# EAGLE design power supply (EAGLE 9.6.2)
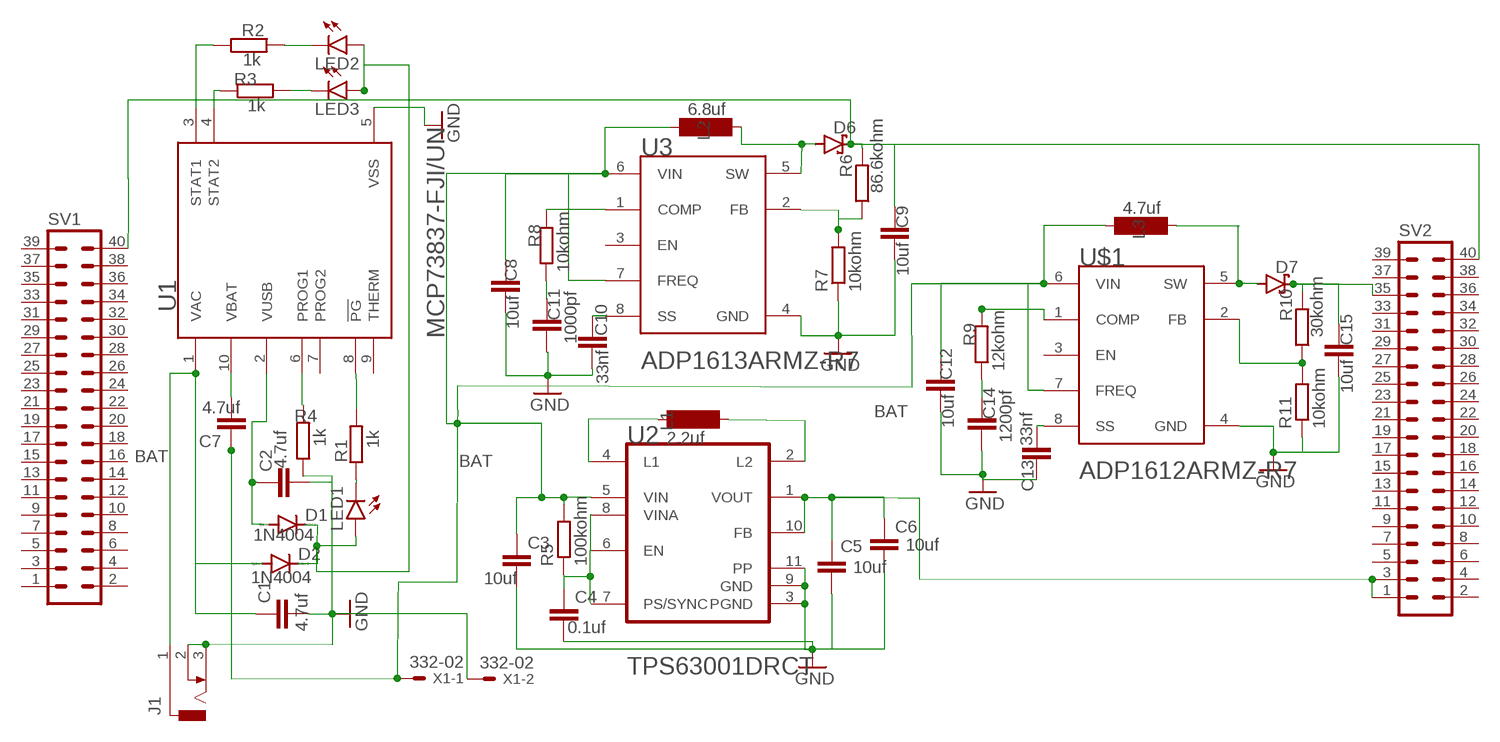
[diagram p0: schematic, sheet 1]

## Parts
C1  4.7uf  C-EU025-024X044  [C025-024X044]
C2  4.7uf  C-EU025-024X044  [C025-024X044]
C3  10uf  C-EUC0201  [C0201]
C4  0.1uf  C-EUC0201  [C0201]
C5  10uf  C-EUC0201  [C0201]
C6  10uf  C-EUC0201  [C0201]
C7  4.7uf  C-EU025-024X044  [C025-024X044]
C8  10uf  C-EUC0201  [C0201]
C9  10uf  C-EUC0201  [C0201]
C10  33nf  C-EUC0201  [C0201]
C11  1000pf  C-EUC0201  [C0201]
C12  10uf  C-EUC0201  [C0201]
C13  33nf  C-EUC0201  [C0201]
C14  1200pf  C-EUC0201  [C0201]
C15  10uf  C-EUC0201  [C0201]
D1  1N4004  [DO41-10]
D2  1N4004  [DO41-10]
D6  P4KEXX  [DO41-10]
D7  P4KEXX  [DO41-10]
J1  DCJ0303  [DCJ0303]
L1  2.2uf  SD75  [SD75]
L2  6.8uf  SD75  [SD75]
L3  4.7uf  SD75  [SD75]
LED1  LED  [SMARTLED-TTW]
LED2  LED  [SMARTLED-TTW]
LED3  LED  [SMARTLED-TTW]
R1  1k  R-EU_01005  [R01005]
R2  1k  R-EU_01005  [R01005]
R3  1k  R-EU_01005  [R01005]
R4  1k  R-EU_01005  [R01005]
R5  100kohm  R-EU_01005  [R01005]
R6  86.6kohm  R-EU_01005  [R01005]
R7  10kohm  R-EU_01005  [R01005]
R8  10kohm  R-EU_01005  [R01005]
R9  12kohm  R-EU_01005  [R01005]
R10  30kohm  R-EU_01005  [R01005]
R11  10kohm  R-EU_01005  [R01005]
SV1  40P  [40P]
SV2  40P  [40P]
U1  MICROCHIP_MCP73837-FJI-UNMICROCHIP_MCP73837-FJI-UN_0_0  [MICROCHIP_MCP73837-FJI-UN_0]
U2  TEXAS_INSTRUMENTS_TPS63001DRCTTEXAS_INSTRUMENTS_TPS63001DRCT_0_0  [TEXAS_INSTRUMENTS_TPS63001DRCT_0]
U3  ANALOG_DEVICES_INC_ADP1613ARMZ-R7ANALOG_DEVICES_INC_ADP1613ARMZ-R7_0_0  [ANALOG_DEVICES_INC_ADP1613ARMZ-R7_0]
U$1  ADP1612  [ADP1612]
X1  332-02  [332-02]

## Nets
BAT: C3.1 C7.1 C8.1 C12.1 L2.1 L3.1 R5.2 U2.5(VIN) U3.6(VIN) U3.7(FREQ) U$1.6(VIN) U$1.7(FREQ) X1.1
BATCHARGEER: D1.C D2.C LED1.A@1(A) LED2.A@1(A) LED3.A@1(A)
GND: C1.2 C2.2 C3.2 C4.2 C5.2 C6.2 C8.2 C9.2 C10.2 C11.2 C12.2 C13.1 C14.2 C15.2 J1.2 J1.3 R4.1 R7.1 R11.1 U1.5(VSS) U2.3(PGND) U2.9(GND) U2.11(PP) U3.4(GND) U$1.4(GND) X1.2
N$1: C1.1 D2.A J1.1 U1.1(VAC)
N$2: C2.1 D1.A U1.2(VUSB)
N$3: R3.1 U1.4(STAT2)
N$4: LED2.C@1(C) R2.2
N$5: R4.2 U1.6(PROG1)
N$6: R1.2 U1.8(!PG!)
N$7: LED1.C@1(C) R1.1
N$8: LED3.C@1(C) R3.2
N$10: R2.1 U1.3(STAT1)
N$11: C13.2 U$1.8(SS)
N$12: C7.2 U1.10(VBAT)
N$13: R9.2 U$1.1(COMP)
N$14: C4.1 R5.1 U2.6(EN) U2.7(PS/SYNC) U2.8(VINA)
N$17: C14.1 R9.1
N$18: L1.1 U2.4(L1)
N$20: L1.2 U2.2(L2)
N$21: C5.1 C6.1 SV2.1 SV2.3 U2.1(VOUT) U2.10(FB)
N$23: R8.2 U3.1(COMP)
N$24: C10.1 U3.8(SS)
N$25: C9.1 D6.C R6.2 SV1.40 SV2.40
N$26: R6.1 R7.2 U3.2(FB)
N$27: C11.1 R8.1
N$30: C15.1 D7.C R10.2 SV2.35
N$31: D7.A U$1.5(SW)
N$32: L3.2
N$33: R10.1 R11.2 U$1.2(FB)
N$34: D6.A L2.2 U3.5(SW)
Unconnected: SV1.1 SV1.2 SV1.3 SV1.4 SV1.5 SV1.6 SV1.7 SV1.8 SV1.9 SV1.10 SV1.11 SV1.12 SV1.13 SV1.14 SV1.15 SV1.16 SV1.17 SV1.18 SV1.19 SV1.20 SV1.21 SV1.22 SV1.23 SV1.24 SV1.25 SV1.26 SV1.27 SV1.28 SV1.29 SV1.30 SV1.31 SV1.32 SV1.33 SV1.34 SV1.35 SV1.36 SV1.37 SV1.38 SV1.39 SV2.2 SV2.4 SV2.5 SV2.6 SV2.7 SV2.8 SV2.9 SV2.10 SV2.11 SV2.12 SV2.13 SV2.14 SV2.15 SV2.16 SV2.17 SV2.18 SV2.19 SV2.20 SV2.21 SV2.22 SV2.23 SV2.24 SV2.25 SV2.26 SV2.27 SV2.28 SV2.29 SV2.30 SV2.31 SV2.32 SV2.33 SV2.34 SV2.36 SV2.37 SV2.38 SV2.39 U1.7(PROG2) U1.9(THERM) U3.3(EN) U$1.3(EN)

## Library data of the parts
C1-C15 = rcl:C-EU: CAPACITOR, European symbol; SPICEPREFIX: C
D1 D2 = diode:1N4004: DIODE general purpose rectifier, 1 A
D6 D7 = diode:P4KEXX: DIODE transient-voltage suppressor
J1 = con-jack:DCJ0303: DC POWER JACK Source: DCJ0303.pdf; OC_FARNELL: unknown; OC_NEWARK: unknown
L1-L3 = inductor-neosid:SD75: INDUCTOR nominal inductance, E12; OC_FARNELL: unknown; OC_NEWARK: unknown
LED1-LED3 = led:LED: LED OSRAM: - CHIPLED LG R971, LG N971, LY N971, LG Q971, LY Q971, LO R971, LY R971 LH N974, LH R974 LS Q976, LO Q976, LY Q976 LO Q996 - Hyper CHIPLED LW Q18S LB Q993, LB Q99A, LB R99A - SideLED LS A670, LO A670, LY A670, LG A670, LP A670 LB A673, LV A673, LT A673, LW A673 LH A674 LY A675 LS A676, LA A676, LO A676, LY A676, LW A676 LS A679, LY A679, LG A679 - Hyper Micro SIDELED® LS Y876, LA Y876, LO Y876, LY Y876 LT Y87S - SmartLED LW L88C, LW L88S LB L89C, LB L89S, LG L890 LS L89K, LO L89K, LY L89K LS L896, LA L896, LO L896, LY L896 - TOPLED LS T670, LO T670, LY T670, LG T670, LP T670 LSG T670, LSP T670, LSY T670, LOP T670, LYG T670 LG T671, LOG T671, LSG T671 LB T673, LV T673, LT T673, LW T673 LH T674 LS T676, LA T676, LO T676, LY T676, LB T676, LH T676, LSB T676, LW T676 LB T67C, LV T67C, LT T67C, LS T67K, LO T67K, LY T67K, LW E67C LS E67B, LA E67B, LO E67B, LY E67B, LB E67C, LV E67C, LT E67C LW T67C LS T679, LY T679, LG T679 LS T770, LO T770, LY T770, LG T770, LP T770 LB T773, LV T773, LT T773, LW T773 LH T774 LS E675, LA E675, LY E675, LS T675 LS T776, LA T776, LO T776, LY T776, LB T776 LHGB T686 LT T68C, LB T68C - Hyper Mini TOPLED® LB M676 - Mini TOPLED Santana® LG M470 LS M47K, LO M47K, LY M47K Source: http://www.osram.convergy.de LUXEON: - LUMILED® LXK2-PW12-R00, LXK2-PW12-S00, LXK2-PW14-U00, LXK2-PW14-V00 LXK2-PM12-R00, LXK2-PM12-S00, LXK2-PM14-U00 LXK2-PE12-Q00, LXK2-PE12-R00, LXK2-PE12-S00, LXK2-PE14-T00, LXK2-PE14-U00 LXK2-PB12-K00, LXK2-PB12-L00, LXK2-PB12-M00, LXK2-PB14-N00, LXK2-PB14-P00, LXK2-PB14-Q00 LXK2-PR12-L00, LXK2-PR12-M00, LXK2-PR14-Q00, LXK2-PR14-R00 LXK2-PD12-Q00, LXK2-PD12-R00, LXK2-PD12-S00 LXK2-PH12-R00, LXK2-PH12-S00 LXK2-PL12-P00, LXK2-PL12-Q00, LXK2-PL12-R00 Source: www.luxeon.com KINGBRIGHT: KA-3528ASYC Source: www.kingbright.com
R1-R11 = rcl:R-EU_: RESISTOR, European symbol; SPICEPREFIX: R
SV1 SV2 = con-dil:40P: DIL CABLE CONNECTOR
U1 = Microchip-MCP73837:MICROCHIP_MCP73837-FJI-UN: Advanced Stand-Alone Li-Ion / Li-Polymer Battery Charge Management Controller with Autonomous AC-Adapter or USB-Port Source Selection; CENTROID_NOT_SPECIFIED: No; DATASHEET: http://ww1.microchip.com/downloads/en/DeviceDoc/22071a.pdf; DIGIKEY_DESCRIPTION: IC LIION CHRGR USB/AC-IN 10MSOP; DIGIKEY_PART_NUMBER: MCP73837-FJI/UN-ND; LEAD_FREE: yes; MF: Microchip; MOUSER_PART_NUMBER: 579-MCP73837-FJI/UN; MPN: MCP73837-FJI/UN; PACKAGE: MSOP10; PREFIX: U; ROHS: yes; TEMPERATURE_RANGE_HIGH: +85°C; TEMPERATURE_RANGE_LOW: -40°C
U2 = Texas Instruments - TPS63001DRCT:TEXAS_INSTRUMENTS_TPS63001DRCT: TI-TPS63001DRC10-3000X1650TP; CIIVA_IDS: 1489690; COMPONENT_LINK_2_DESCRIPTION: Package Specification; COMPONENT_LINK_2_URL: http://www.ti.com/litv/pdf/mpds117k; DATASHEET: http://www.ti.com/general/docs/lit/getliterature.tsp?genericPartNumber=TPS63001&fileType=pdf; DATASHEET_VERSION: SLVS520B; DYNAMIC_VOLTAGE_SCALING: true; FOOTPRINT_VARIANT_NAME_0: Manufacturer Recommended; IMPORTED: yes; IMPORTED_FROM: vault; IMPORT_TS: 1521844474; IOUT_MAX_A: 1.2; IQ_TYPM_A: 0.03; MF: Texas Instruments; MOUNTING_TECHNOLOGY: Surface Mount; MPN: TPS63001DRCT; PACKAGE: DRC0010J; PACKAGE_DESCRIPTION: 10-Pin Plastic Small Outline No-Lead, 3 x 3 x 1 mm Body, 0.5 mm Pitch, Exposed Pad; PACKAGE_VERSION: revL, Sep-2011; PREFIX: U; PRESET_VOUTV: 3.3; REGULATED_OUTPUTS: 1; RELEASE_DATE: 1464604456; ROHS: Yes; SUB_FAMILY: Buck-Boost Regulator; SWITCHING_FREQUENCYMAXKHZ: 1500; SYNCHRONOUS_RECTIFICATION: true; TOPOLOGY: Buck-Boost; VAULT_GUID: 716ED092-ED52-49D4-9072-09F38C28E61B; VAULT_REVISION: 93282931-FE10-4779-AF11-DABD529239E2; VIN_MAX_V: 5.5; VIN_MIN_V: 1.8; VOUT_MAX_V: 3.3; VOUT_MIN_V: 3.3
U3 = Analog Devices Inc - ADP1613ARMZ-R7:ANALOG_DEVICES_INC_ADP1613ARMZ-R7: 650 kHz /1.3 MHz Step -Up PWM DC - to - DC Switching Converters; CENTROID_NOT_SPECIFIED: No; DATASHEET: http://www.analog.com/media/en/technical-documentation/data-sheets/ADP1612_1613.pdf; DIGIKEY_DESCRIPTION: IC ADP1613ARMZ-R7; DIGIKEY_PART_NUMBER: ADP1613ARMZ-R7CT-ND; IPC_LAND_PATTERN_NAME: SOP65P490X110-8; LEAD_FREE: yes; MF: Analog Devices Inc; MOUSER_PART_NUMBER: 584-ADP1613ARMZ-R7; MPN: ADP1613ARMZ-R7; PACKAGE: MSOP8; PREFIX: U; ROHS: yes; TEMPERATURE_RANGE_HIGH: +125°C; TEMPERATURE_RANGE_LOW: -40°C
U$1 = adp1612armz:ADP1612
X1 = con-garry:332-02: 2 Pin - 2mm Dual Row Source: www.mpe-connector.de / garry_shortform_2012.pdf

## Board
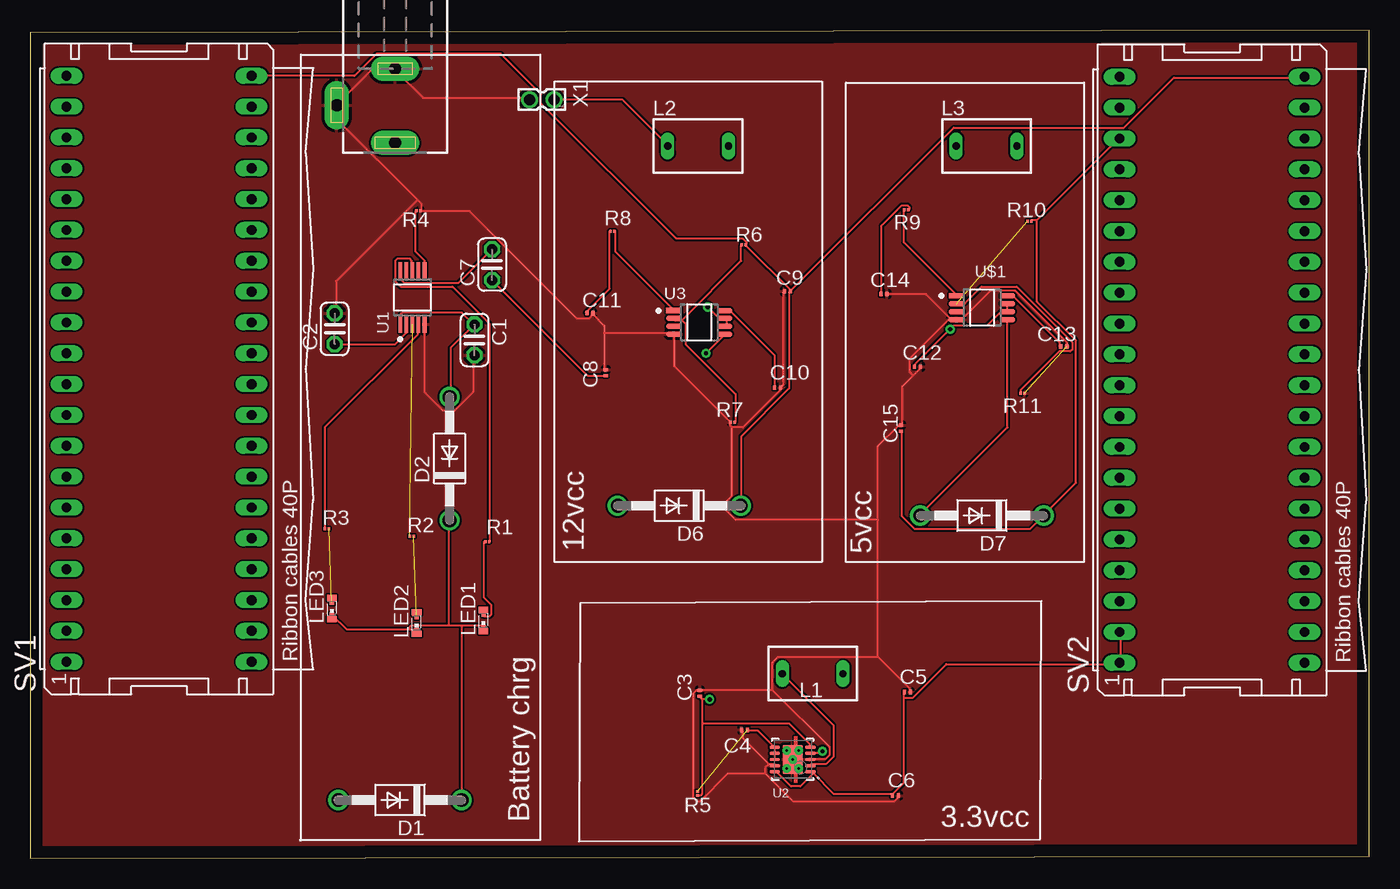
[diagram p1: board, top side]
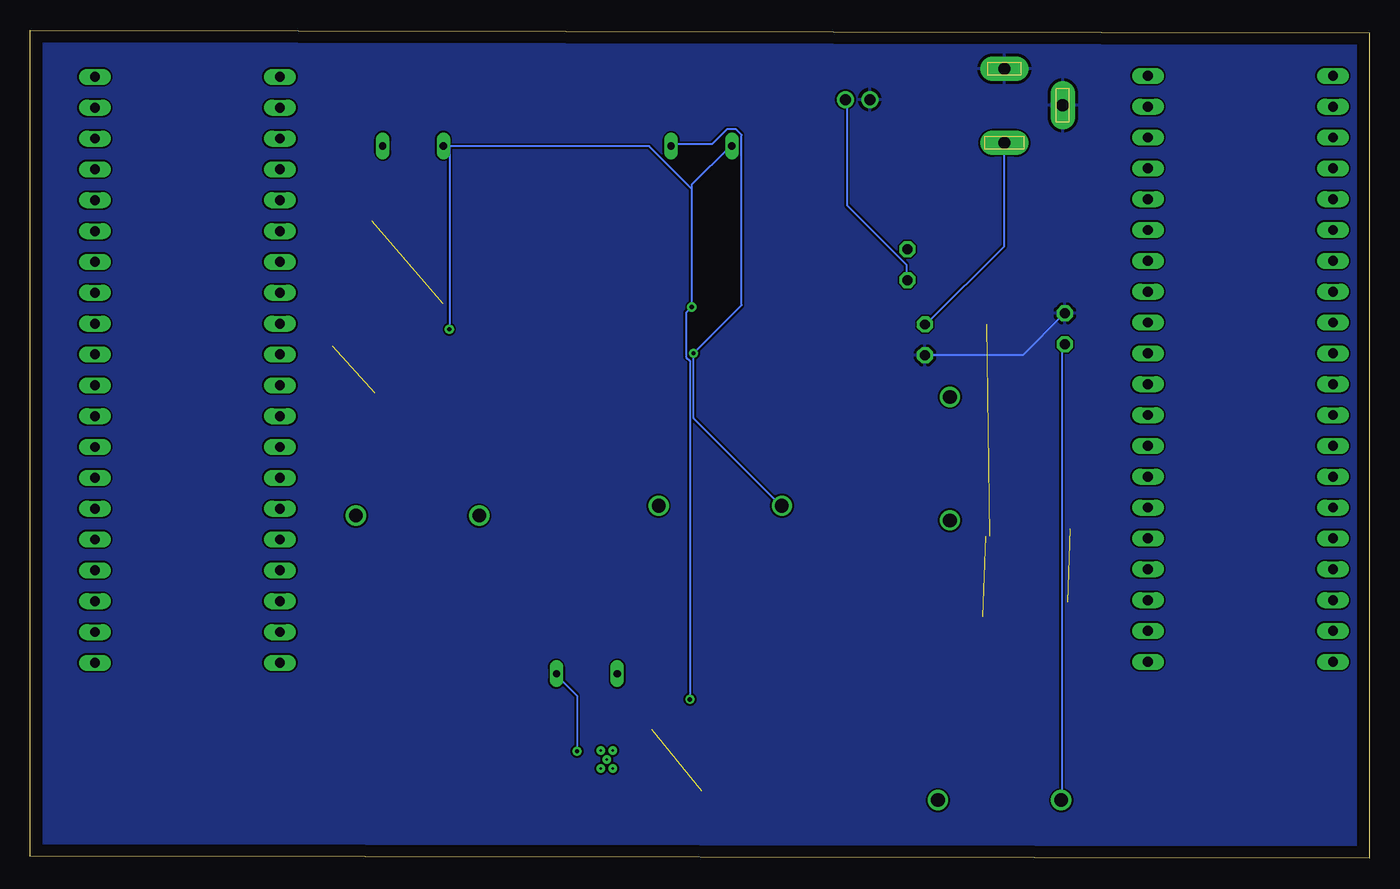
[diagram p2: board, bottom side, seen from below]

Size 110.3 x 68.2 mm. Coordinates in mm from the lower left corner, seen from the top.
Outline: 0,0 110.3,0.2 110.3,68.2 0,68 0,0
Copper layers (1*16): Top 0.035mm / dielectric 1.5mm / Bottom 0.035mm
Design rules "default": minimum track width 6mil, minimum drill 0.35mm, track to track 6mil, track to pad 6mil, pad to pad 6mil, via to via 6mil, smd to smd 6mil, copper to edge 40mil, drill to drill 6mil, minimum pad ring 10mil, minimum via ring 8mil, stop-mask expansion 4mil, vias tented up to drill 0mil, thermal gap 10mil

### Footprints (pad centres in the part's own frame; a part is rotated, then mirrored left to right if it is on the bottom)
C025-024X044 = drill 0.813 octagon: 1 -1.27,0; 2 1.27,0
C0201 = smd 0.25 x 0.35: 1 -0.25,0; 2 0.25,0
DO41-10 = drill 1.118: A 5.08,0; C -5.08,0
DCJ0303 = drill 1 pad 2 long: 1 0,3.1; 2 4.8,0; 3 0,-3
SD75 = drill 0.6 long: 1 -2.5,0; 2 2.5,0
SMARTLED-TTW = smd 0.8 x 0.5: A 0,-0.875; C 0,0.875 | smd 0.35 x 0.35: A@1 0,-0.5; C@1 0,0.5
R01005 = smd 0.2 x 0.25: 1 -0.163,0; 2 0.163,0
40P = drill 0.813 long: 1 -24.13,7.62; 2 -24.13,-7.62; 3 -21.59,7.62; 4 -21.59,-7.62; 5 -19.05,7.62; 6 -19.05,-7.62; 7 -16.51,7.62; 8 -16.51,-7.62; 9 -13.97,7.62; 10 -13.97,-7.62; 11 -11.43,7.62; 12 -11.43,-7.62; 13 -8.89,7.62; 14 -8.89,-7.62; 15 -6.35,7.62; 16 -6.35,-7.62; 17 -3.81,7.62; 18 -3.81,-7.62; 19 -1.27,7.62; 20 -1.27,-7.62; 21 1.27,7.62; 22 1.27,-7.62; 23 3.81,7.62; 24 3.81,-7.62; 25 6.35,7.62; 26 6.35,-7.62; 27 8.89,7.62; 28 8.89,-7.62; 29 11.43,7.62; 30 11.43,-7.62; 31 13.97,7.62; 32 13.97,-7.62; 33 16.51,7.62; 34 16.51,-7.62; 35 19.05,7.62; 36 19.05,-7.62; 37 21.59,7.62; 38 21.59,-7.62; 39 24.13,7.62; 40 24.13,-7.62
MICROCHIP_MCP73837-FJI-UN_0 = smd 0.3 x 1.4: 1 -1,-2.2; 2 -0.5,-2.2; 3 0,-2.2; 4 0.5,-2.2; 5 1,-2.2; 6 1,2.2; 7 0.5,2.2; 8 0,2.2; 9 -0.5,2.2; 10 -1,2.2
TEXAS_INSTRUMENTS_TPS63001DRCT_0 = smd 0.85 x 0.28: 1 -1.475,1; 2 -1.475,0.5; 3 -1.475,0; 4 -1.475,-0.5; 5 -1.475,-1; 6 1.475,-1; 7 1.475,-0.5; 8 1.475,0; 9 1.475,0.5; 10 1.475,1 | smd 1.65 x 2.4: 11 0,0 | drill 0.2 pad 0.5: PAD_1 0.5,-0.75; PAD_2 -0.5,-0.75; PAD_3 -0.5,0.75; PAD_4 0.5,0.75; PAD_5 0,0
ANALOG_DEVICES_INC_ADP1613ARMZ-R7_0 = smd 1.254 x 0.436: 1 -2.1,0.975; 2 -2.1,0.325; 3 -2.1,-0.325; 4 -2.1,-0.975; 5 2.1,-0.975; 6 2.1,-0.325; 7 2.1,0.325; 8 2.1,0.975
ADP1612 = smd 1.254 x 0.436: 1 -0.84,2.615; 2 -0.84,1.965; 3 -0.84,1.315; 4 -0.84,0.665; 5 3.36,0.665; 6 3.36,1.315; 7 3.36,1.965; 8 3.36,2.615
332-02 = drill 0.9 pad 1.27: 1 0,-1; 2 0,1

### Placement (x,y rotation side)
C1  36.59,42.71 270 top
C2  25.07,43.62 90 top
C3  55.16,13.61 90 top
C4  58.85,10.58 180 top
C5  72.25,13.7 0 top
C6  71.28,5.18 0 top
C7  38.04,48.9 90 top
C8  47.4,40 90 top
C9  62.36,46.71 180 top
C10  61.56,38.76 0 top
C11  46.1,44.92 0 top
C12  73.09,40.51 0 top
C13  85.13,42.17 180 top
C14  70.33,46.49 0 top
C15  71.73,35.45 90 top
D1  30.45,4.81 180 top
D2  34.54,32.93 90 top
D6  53.46,29.05 180 top
D7  78.4,28.24 180 top
J1  30.05,62.03 180 top
L1  64.45,15.22 180 top
L2  55.01,58.67 0 top
L3  78.77,58.68 0 top
LED1  37.33,19.59 0 top
LED2  31.82,19.39 0 top
LED3  24.84,20.59 0 top
R1  37.63,26.07 0 top
R2  31.42,26.54 0 top
R3  24.44,27.14 0 top
R4  31.96,53.35 180 top
R5  54.97,5.36 270 top
R6  58.77,50.56 0 top
R7  57.87,35.93 0 top
R8  47.96,51.65 0 top
R9  72.17,53.43 180 top
R10  82.31,52.48 0 top
R11  81.74,38.32 180 top
SV1  10.6,40.33 90 top
SV2  97.36,40.24 90 top
U1  31.48,46.21 0 top
U2  62.8,8.15 180 top
U3  55.11,44.15 0 top
U$1  77.15,43.72 0 top
X1  42.14,62.5 90 top

### Tracks (layer width: path | path; a pad name or v marks a point on that pad's centre or on a via)
BAT  (via drill 0.35)
  Top 0.152: C8.1 47.28,39.77 45.91,39.77 38.13,47.54 C7.1 | 55.35,13.1 55.35,11.12 | 55.35,11.12 55.35,5.33 55.2,5.18 55.05,5.18 R5.2 | 55.35,13.1 55.2,13.25 C3.1 | 55.35,11.12 62.52,11.12 64.19,9.44 64.19,9.14 U2.5 | C12.1 72.88,40.53 72.88,40.69 v75.78,43.58 76.08,43.89 78.82,43.89 79.89,44.95 80.5,44.95 U$1.6 80.5,45.1 80.5,45.56 U$1.7 | U3.6 57.34,43.89 57.34,44.34 U3.7 57.18,44.5 56.73,44.5 v55.81,45.41 | X1.1 43.16,62.48 48.8,62.48 52.46,58.82 L2.1 | v55.96,13.1 55.35,13.1
  Bottom 0.152: 55.81,55.16 55.81,55.47 52.61,58.67 L2.1 | 55.81,55.16 v55.81,45.41 56.27,44.95 56.27,41.3 55.96,40.99 v55.96,13.1 | 75.78,58.67 59.32,58.67 55.81,55.16 | 75.78,58.67 76.23,58.67 L3.1 75.78,58.67 | 75.78,58.67 v75.78,43.58 | C7.1 38.13,47.7 38.13,48.91 43.01,53.79 43.01,62.48 X1.1
BATCHARGEER
  Top 0.152: 31.12,18.89 26.04,18.89 LED3.A@1 | 31.12,18.89 LED2.A@1 | 34.48,19.2 31.43,19.2 31.12,18.89 | 34.48,19.2 35.54,19.2 | 35.54,19.2 37.22,19.2 LED1.A@1 | 34.48,19.2 34.48,27.73 D2.C | 35.54,19.2 35.54,4.87 D1.C
GND  (1 unrouted)
  Top 0.152: 47.28,43.28 47.28,43.89 46.36,44.8 | 47.28,43.28 47.28,40.23 C8.2 | 47.28,43.28 52.92,43.28 U3.4 53.07,43.12 53.07,40.53 57.64,35.96 | 57.64,35.96 57.64,35.66 57.79,35.5 | 57.79,35.5 58.71,35.5 61.91,38.7 C10.2 61.91,38.86 62.06,39.01 62.06,46.63 C9.2 | 57.64,35.96 R7.1 | X1.2 41.03,62.63 32.34,62.63 30.06,64.92 J1.3 29.9,64.92 28.07,64.92 25.33,62.17 J1.2 25.33,62.02 25.33,60.8 31.88,54.25 | U1.5 32.49,43.89 32.49,38.4 34.02,36.88 34.93,36.88 36.46,38.4 36.46,41.3 C1.2 | 32.19,53.34 32.19,53.94 31.88,54.25 | 31.88,54.25 25.18,47.54 25.18,44.95 C2.2 | 46.36,44.8 46.06,44.5 44.99,44.5 36.15,53.34 32.19,53.34 | 46.36,44.8 C11.2 | 32.19,53.34 R4.1 | 72.73,39.77 73.34,40.38 C12.2 | 72.73,39.77 71.81,38.86 71.81,35.81 C15.2 71.66,35.66 71.51,35.66 69.83,33.98 69.83,27.88 | C13.1 85.38,42.21 85.38,42.51 81.11,46.78 79.13,46.78 76.84,44.5 76.39,44.5 U$1.4 | 75.78,44.5 73.8,46.48 70.59,46.48 C14.2 | 75.78,44.5 76.23,44.5 U$1.4 | 72.73,39.77 72.42,40.08 72.42,41.14 75.78,44.5 | 75.78,44.5 U$1.4 | 60.84,7.77 58.71,9.9 58.71,10.51 C4.2 | 60.84,7.77 61.3,7.77 U2.9 | 60.54,7 62.82,4.72 71.2,4.72 71.51,5.02 71.51,5.18 C6.2 | 60.54,7 60.54,7.46 60.84,7.77 | 61.15,13.86 55.2,13.86 C3.2 55.05,13.86 54.9,13.86 54.59,13.56 54.59,5.02 54.9,4.72 55.2,4.72 57.49,7 60.54,7 | 61.15,13.86 65.87,9.14 65.87,8.53 65.57,8.22 64.35,8.22 U2.3 | 69.83,16.61 72.42,14.02 72.42,13.71 C5.2 | 69.83,16.61 61.6,16.61 61.15,16.15 61.15,13.86 | 69.83,16.61 69.83,27.88 | 57.79,35.5 57.79,29.86 57.34,29.41 57.34,28.65 58.1,27.88 69.83,27.88
  Bottom 0.152: C1.2 36.46,41.45 28.53,41.45 25.18,44.8 C2.2
  pour Top: -1.9,73.2 111.6,73.2 111.6,-0.9 -2,-0.9 -2,73.2
  pour Bottom: -3.1,74.6 112.7,74.6 112.7,-1.3 -3.1,-1.3
N$1
  Top 0.152: U1.1 30.51,44.04 30.51,44.8 30.67,44.95 35.54,44.95 36.46,44.04 C1.1 36.46,43.89 34.63,42.06 34.63,38.09 D2.A
  Bottom 0.152: J1.1 30.06,58.82 30.06,50.44 36.46,44.04 C1.1
N$2
  Top 0.152: U1.2 30.97,43.89 30.97,43.28 30.06,42.36 25.18,42.36 C2.1
  Bottom 0.152: D1.A 25.33,4.87 25.33,42.06 25.18,42.21 C2.1
N$3
  Top 0.152: R3.1 24.26,27.12 24.26,35.5 31.88,43.12 31.88,43.89 U1.4
N$4  (1 unrouted)
N$5
  Top 0.152: R4.2 31.73,53.34 31.73,49.98 32.49,49.22 32.49,48.46 U1.6
N$6
  Top 0.152: R1.2 37.83,26.05 37.83,44.04 34.78,47.09 30.51,47.09 30.06,47.54 30.06,49.22 30.21,49.37 31.28,49.37 31.43,49.22 31.43,48.46 U1.8
N$7
  Top 0.152: R1.1 37.37,26.05 37.37,21.48 37.98,20.87 37.98,20.11 37.83,19.96 37.37,19.96 LED1.C@1
N$8  (1 unrouted)
N$10  (1 unrouted)
N$11
  Top 0.152: C13.2 84.77,42.21 84.77,42.51 80.96,46.32 80.65,46.32 U$1.8
N$12
  Top 0.152: U1.10 30.51,48.31 30.51,47.7 30.82,47.39 35.24,47.39 37.98,50.13 C7.2
N$13
  Top 0.152: R9.2 71.97,53.34 71.97,50.74 76.23,46.48 U$1.1
N$14  (1 unrouted)
  Top 0.152: U2.8 61.3,8.22 61.3,8.53 U2.7 61.3,8.68 61.3,9.14 | 61.3,9.14 59.93,10.51 59.16,10.51 C4.1 | 61.3,9.14 U2.6
N$17
  Top 0.152: R9.1 72.42,53.49 72.42,53.64 72.27,53.79 71.81,53.79 70.14,52.12 70.14,46.63 C14.1
N$18  (via drill 0.35)
  Top 0.152: v65.26,8.83 65.11,8.68 64.35,8.68 U2.4
  Bottom 0.152: v65.26,8.83 65.26,13.41 66.94,15.08 L1.1
N$20
  Top 0.152: U2.2 64.35,7.77 65.57,7.77 66.18,8.38 66.18,10.97 62.06,15.08 L1.2
N$21
  Top 0.152: SV2.3 89.8,18.59 89.8,16.15 SV2.1 89.65,16 75.47,16 72.73,13.25 71.97,13.25 | 71.05,5.33 66.18,5.33 64.5,7 | 64.5,7 64.35,7.16 U2.1 | 71.97,13.25 71.97,6.24 71.05,5.33 | 71.97,13.25 71.97,13.56 C5.1 | 71.05,5.33 C6.1 | 64.5,7 63.43,5.94 62.67,5.94 61.45,7.16 U2.10
N$23
  Top 0.152: R8.2 48.19,51.66 48.19,49.98 52.92,45.26 U3.1
N$24
  Top 0.152: C10.1 61.3,38.86 61.3,41.45 57.64,45.1 57.34,45.1 U3.8
N$25
  Top 0.152: 62.67,46.78 59.01,50.44 R6.2 59.01,50.59 59.01,50.74 58.71,51.05 53.22,51.05 42.1,62.17 42.1,62.94 38.74,66.29 28.53,66.29 26.7,64.46 SV1.40 | 62.67,46.78 76.08,60.19 90.1,60.19 94.22,64.31 104.89,64.31 SV2.40 | 62.67,46.78 C9.1 62.52,46.63 62.52,38.7 58.55,34.74 58.55,29.1 D6.C
N$26
  Top 0.152: 53.68,44.34 53.98,44.04 53.98,42.36 58.1,38.25 58.1,35.96 R7.2 | 53.68,44.34 53.07,44.34 U3.2 | 53.68,44.34 58.55,49.22 58.55,50.44 R6.1
N$27
  Top 0.152: R8.1 47.73,51.66 47.73,46.93 45.75,44.95 C11.1
N$30
  Top 0.152: 82.94,52.57 82.48,52.57 R10.2 | 82.94,52.57 89.65,59.28 SV2.35 | C15.1 71.81,35.2 71.81,28.19 72.88,27.12 82.33,27.12 83.4,28.19 D7.C 83.55,28.34 86.14,30.93 86.14,42.67 82.94,45.87 82.94,52.57
N$31
  Top 0.152: U$1.5 80.5,44.34 80.5,35.5 73.34,28.34 D7.A
N$33  (1 unrouted)
  Top 0.152: R11.2 81.57,38.4 81.57,38.55 84.77,41.75 85.68,41.75 85.84,41.91 85.84,42.51 81.26,47.09 78.37,47.09 77,45.72 76.39,45.72 U$1.2
N$34  (via drill 0.35)
  Top 0.152: v55.66,41.6 57.18,43.12 U3.5
  Bottom 0.152: D6.A 48.5,29.1 55.66,36.27 v55.66,41.6 51.7,45.56 51.7,59.58 52.15,60.04 52.92,60.04 54.14,58.82 57.49,58.82 L2.2

### Text on the board
tNames: 12vcc | 5vcc | Battery chrg | 3.3vcc